# EasyEDA Pro project ProProject_PetCareSTM32_MiniSTM32_2024-08-27_1.epro

# Schematic Schematic1
Create Date: 2024-08-11; Page Name: P1; Project Name: PetCareSTM32_MiniSTM32; Schematic Name: Schematic1; Update Date: 2024-08-25; Company: 嘉立创EDA; Page Size: A4; Version: V1.0
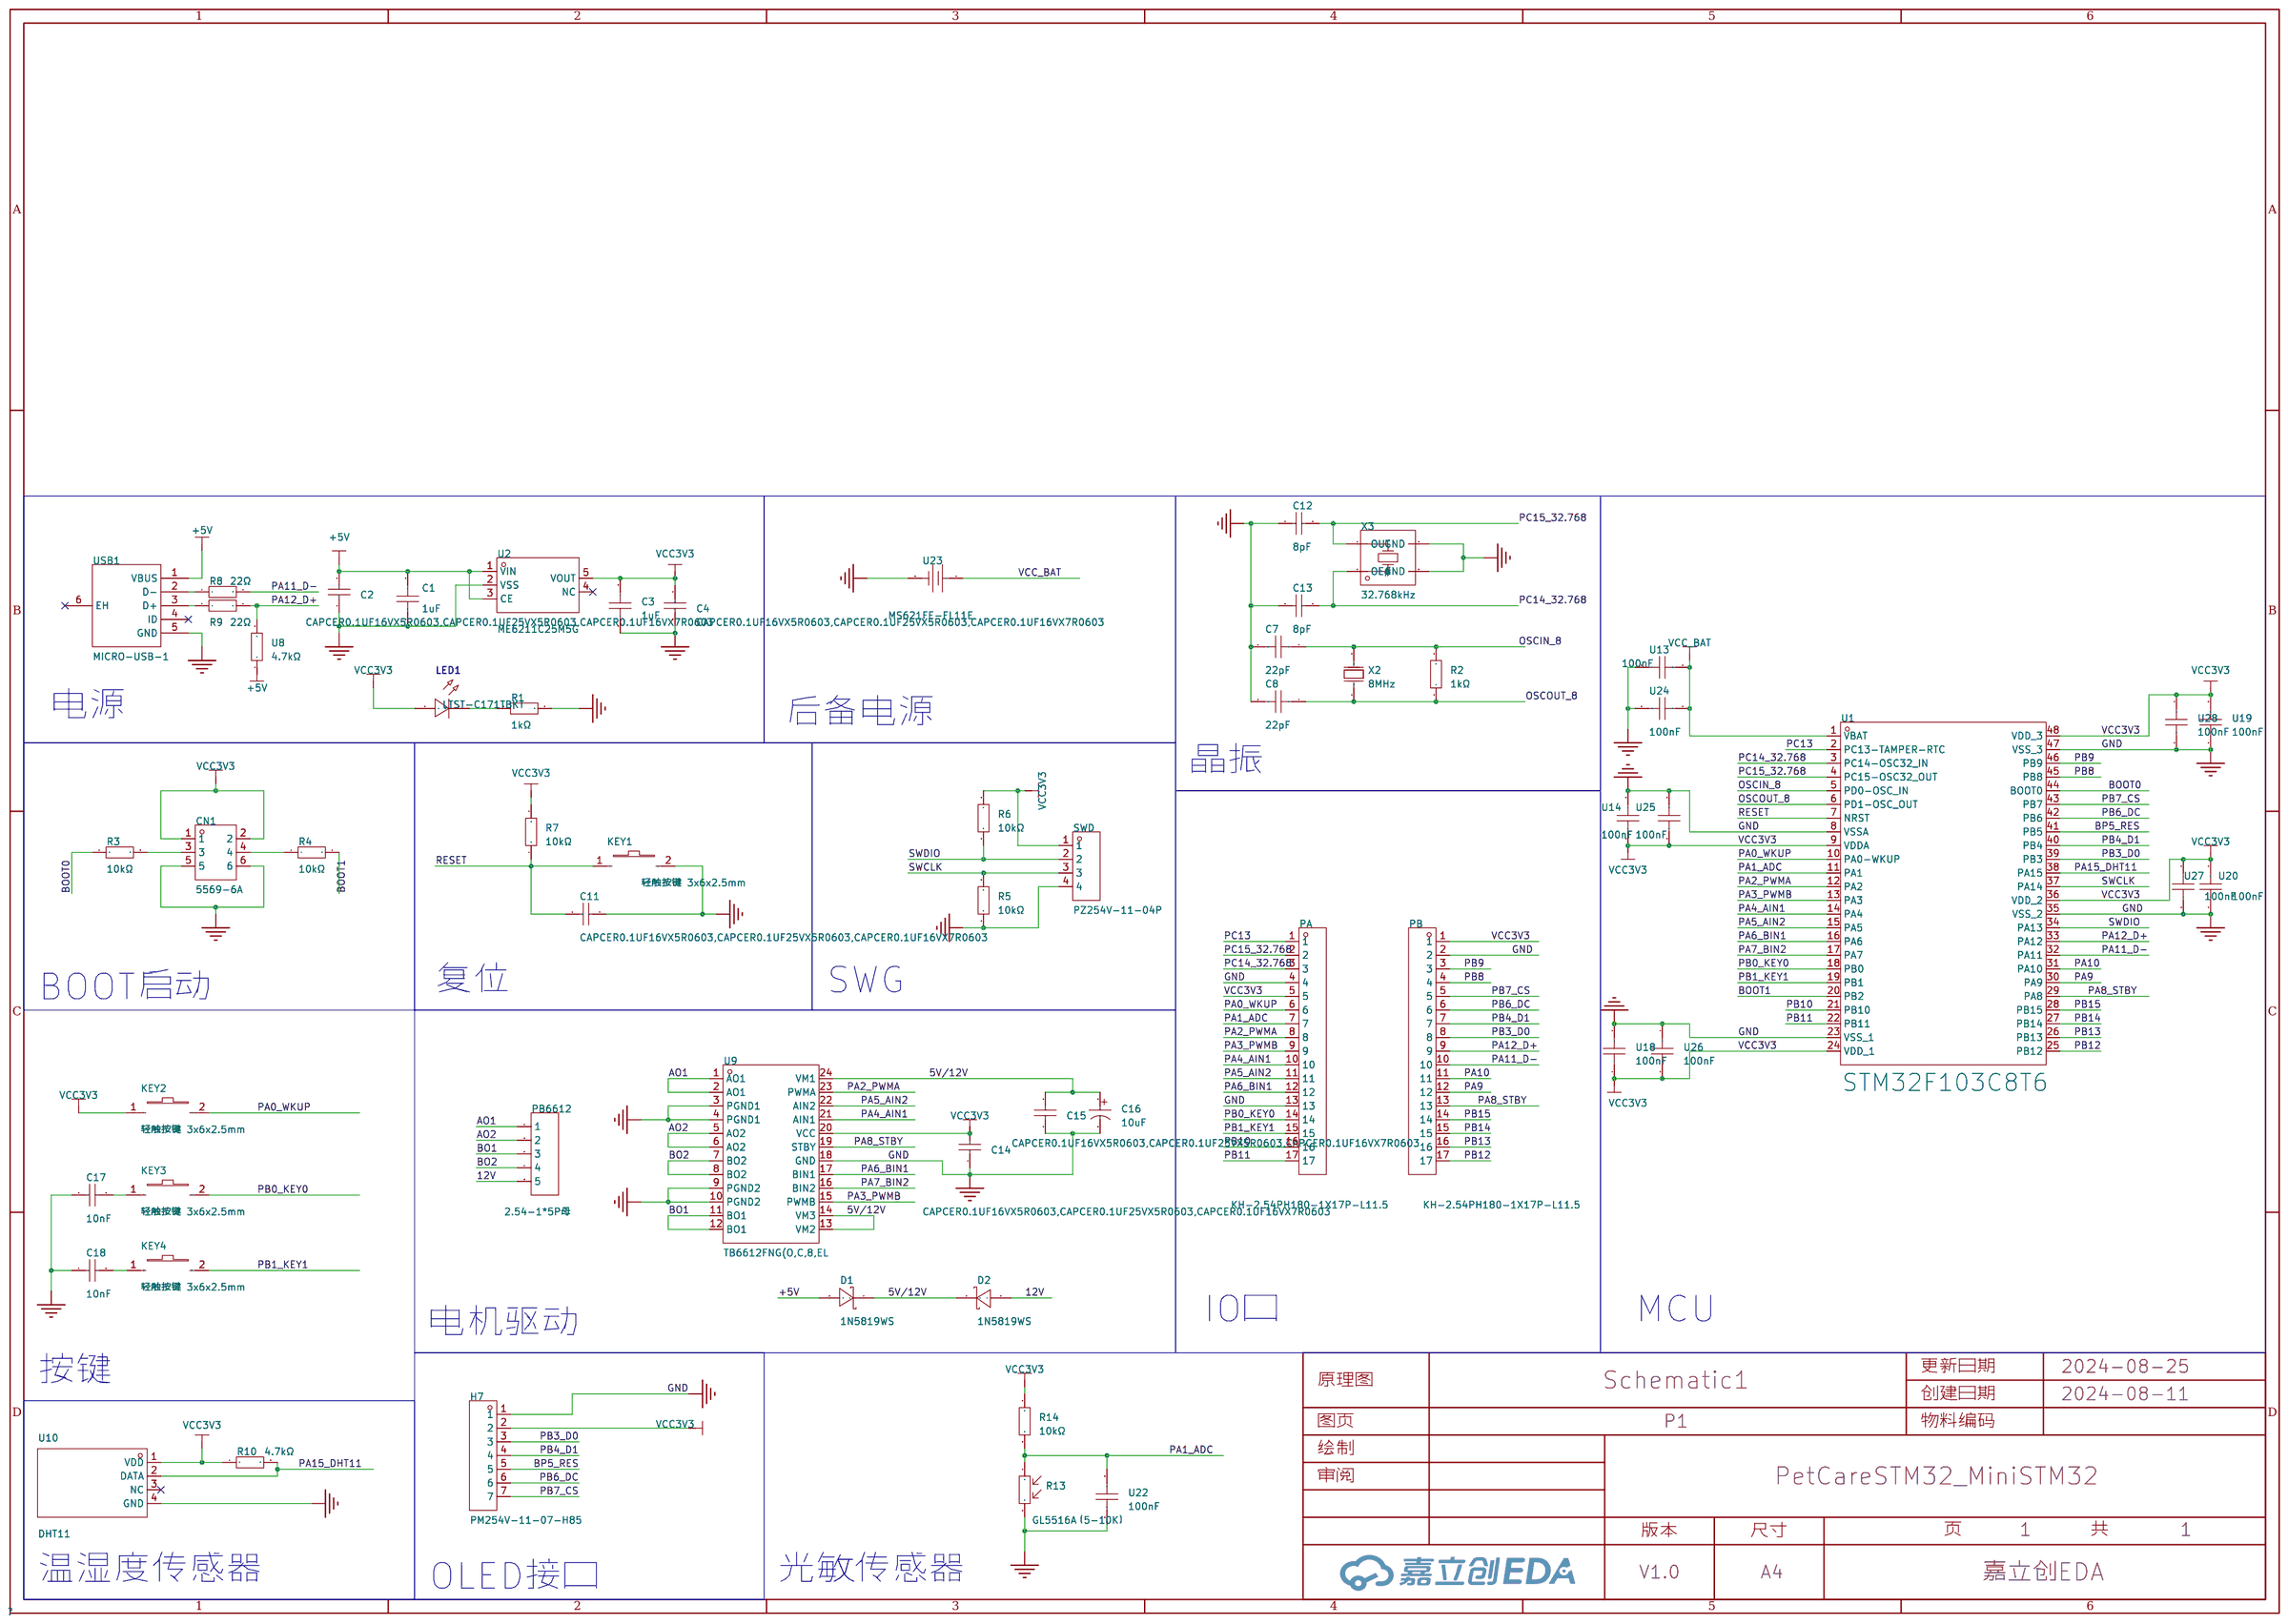
[diagram p0: schematic sheet]

## Parts
C1  1uF  [C0603]
C2  CAPCER0.1UF16VX5R0603,CAPCER0.1UF25VX5R0603,CAPCER0.1UF16VX7R0603  [C0603]
C3  1uF  [C0603]
C4  CAPCER0.1UF16VX5R0603,CAPCER0.1UF25VX5R0603,CAPCER0.1UF16VX7R0603  [C0603]
C7  22pF  [C0603]
C8  22pF  [C0603]
C11  CAPCER0.1UF16VX5R0603,CAPCER0.1UF25VX5R0603,CAPCER0.1UF16VX7R0603  [C0603]
C12  8pF  [C0603]
C13  8pF  [C0603]
C14  CAPCER0.1UF16VX5R0603,CAPCER0.1UF25VX5R0603,CAPCER0.1UF16VX7R0603  [C0603]
C15  CAPCER0.1UF16VX5R0603,CAPCER0.1UF25VX5R0603,CAPCER0.1UF16VX7R0603  [C0603]
C16  10uF  [CAP-TH_BD5.0-P2.00-D0.8-FD]
C17  10nF  [C0603]
C18  10nF  [C0603]
CN1  5569-6A  [CONN-TH_6P-P4.20_5569-6A-1]
D1  1N5819WS  [SOD-323_L1.8-W1.3-LS2.5-RD]
D2  1N5819WS  [SOD-323_L1.8-W1.3-LS2.5-RD]
H7  PM254V-11-07-H85  [HDR-TH_7P-P2.54-V-F]
KEY1  轻触按键 3x6x2.5mm  [SW-SMD_L6.0-W3.6-LS8.0]
KEY2  轻触按键 3x6x2.5mm  [SW-SMD_L6.0-W3.6-LS8.0]
KEY3  轻触按键 3x6x2.5mm  [SW-SMD_L6.0-W3.6-LS8.0]
KEY4  轻触按键 3x6x2.5mm  [SW-SMD_L6.0-W3.6-LS8.0]
LED1  LTST-C171TBKT  [LED0805-RD_BLUE]
PA  KH-2.54PH180-1X17P-L11.5  [HDR-TH_17P-P2.54-V-M]
PB  KH-2.54PH180-1X17P-L11.5  [HDR-TH_17P-P2.54-V-M]
PB6612  2.54-1*5P母  [HDR-TH_5P-P2.54-V-F]
R1  1kΩ  [R0603]
R2  1kΩ  [R0603]
R3  10kΩ  [R0603]
R4  10kΩ  [R0603]
R5  10kΩ  [R0603]
R6  10kΩ  [R0603]
R7  10kΩ  [R0603]
R8  22Ω  [R0805]
R9  22Ω  [R0805]
R10  4.7kΩ  [R1206]
R13  GL5516A（5-10K）  [RES-TH_L5.1-W4.3-P3.40_GL55]
R14  10kΩ  [R0603]
SWD  PZ254V-11-04P  [HDR-TH_4P-P2.54-V-M]
U1  STM32F103C8T6  [LQFP-48_L7.0-W7.0-P0.50-LS9.0-BL]
U2  ME6211C25M5G  [SOT-23-5_L2.9-W1.7-P0.95-LS2.8-BL]
U8  4.7kΩ  [R0603]
U9  TB6612FNG(O,C,8,EL  [SSOP-24_L8.4-W5.8-P0.65-LS7.8-BL]
U10  DHT11  [SENSOR-TH_DHT11]
U13  100nF  [C0603]
U14  100nF  [C0603]
U18  100nF  [C0603]
U19  100nF  [C0603]
U20  100nF  [C0603]
U22  100nF  [C0603]
U23  MS621FE-FL11E  [BAT-SMD_FL11E]
U24  100nF  [C0603]
U25  100nF  [C0603]
U26  100nF  [C0603]
U27  100nF  [C0603]
U28  100nF  [C0603]
USB1  MICRO-USB-1  [MICRO-USB-SMD_C9900008946]
X2  8MHz  [OSC-SMD_L5.0-W3.2]
X3  32.768kHz  [CRYSTAL-SMD_4P-L8.0-W3.8-BL]

## Library data of the parts
C1 C3 = CL10A105KB8NNNC: 容值:1uF;精度:±10%;额定电压:50V;材质(温度系数):X5R;; LCSC Part Name: 1uF ±10% 50V; Supplier Part: C15849; Manufacturer: SAMSUNG(三星); Supplier Footprint: 0603; JLCPCB Part Class: Basic Part; Datasheet: https://atta.szlcsc.com/upload/public/pdf/source/20160218/1457707763339.pdf; Supplier: LCSC; Tolerance: ±10%; Voltage Rated: 50V; Temperature Coefficient: X5R
C2 C4 C11 C14 C15 = CAPCER0.1UF16VX5R0603,CAPCER0.1UF25VX5R0603,CAPCER0.1UF16VX7R0603: Supplier Part: C9900012833; JLCPCB Part Class: Extended Part; Supplier: LCSC
C7 C8 = CL10C220JB81PNC: 容值:22pF;精度:±5%;额定电压:50V;材质(温度系数):C0G;; LCSC Part Name: 22pF ±5% 50V; Supplier Part: C170132; Manufacturer: SAMSUNG(三星); Supplier Footprint: 0603; JLCPCB Part Class: Extended Part; Datasheet: https://atta.szlcsc.com/upload/public/pdf/source/20180126/C170132_15169630833661310807.pdf; Supplier: LCSC; Tolerance: ±5%; Voltage Rated: 50V; Temperature Coefficient: C0G
C12 C13 = 0603CG8R0C500NT: 容值:8pF;额定电压:50V;材质(温度系数):C0G;; LCSC Part Name: 8pF 50V; Supplier Part: C36508; Manufacturer: FH(风华); Supplier Footprint: 0603; JLCPCB Part Class: Extended Part; Datasheet: https://atta.szlcsc.com/upload/public/pdf/source/20200305/C486355_26A10D38EF8C2A5C37091D0039909270.pdf; Supplier: LCSC; Voltage Rated: 50V; Temperature Coefficient: C0G
C16 = KF100M025C110A: 容值:10uF;精度:±20%;额定电压:25V;; LCSC Part Name: 10uF ±20% 25V; Supplier Part: C62930; Manufacturer: CapXon(丰宾); Supplier Footprint: 插件,D5xL11mm; JLCPCB Part Class: Extended Part; Datasheet: https://atta.szlcsc.com/upload/public/pdf/source/20160702/1467448308274.pdf; Supplier: LCSC; Tolerance: ±20%; Rated Voltage: 25V; Lead Spacing: 2mm; φD: 5mm; L: 11mm; Lifetime @ Temp: 2000hrs@105℃
C17 C18 = CC0603KRX7R9BB103: 容值:10nF;精度:±10%;额定电压:50V;材质(温度系数):X7R;; LCSC Part Name: 10nF ±10% 50V; Supplier Part: C100042; Manufacturer: YAGEO(国巨); Supplier Footprint: 0603; JLCPCB Part Class: Extended Part; Datasheet: https://atta.szlcsc.com/upload/public/pdf/source/20181008/C309510_22F155564471FAF6A489F7D68F34234E.pdf; Supplier: LCSC; Tolerance: ±10%; Voltage Rated: 50V; Temperature Coefficient: X7R
CN1 = 5569-6A: Supplier Part: C9900070523; Supplier Footprint: 2*3p; JLCPCB Part Class: Extended Part; Supplier: LCSC
D1 D2 = 1N5819WS_C191023: 正向压降(Vf):600mV@1A;直流反向耐压(Vr):40V;平均整流电流(Io):1A;; LCSC Part Name: 电压:40V 电流:1A; Supplier Part: C191023; Manufacturer: Hottech(合科泰); Supplier Footprint: SOD-323; JLCPCB Part Class: Basic Part; Datasheet: https://atta.szlcsc.com/upload/public/pdf/source/20220428/3CB86FD8D28D653594B4E35F9D5AEFD9.pdf; Supplier: LCSC; Forward Voltage (Vf@If): 600mV@1A; Reverse Voltage (Vr): 40V; Average Rectified Current (Io): 1A
H7 = PM254V-11-07-H85: 插孔结构:1x7P;间距:2.54mm;行距:-;圆孔/方孔:方孔;安装类型:直插;排数:单排;总孔位数:7P;额定电流:3A;额定电压:250V;插孔方向:顶部;塑高:-;工作温度范围:-40℃~+105℃;; LCSC Part Name: 间距:2.54mm 1x7P 直插; Supplier Part: C2832270; Manufacturer: XFCN(兴飞); Supplier Footprint: 插件,P=2.54mm; JLCPCB Part Class: Extended Part; Datasheet: https://atta.szlcsc.com/upload/public/pdf/source/20210514/C2832270_F424CC0071A81298BFB56B53406F9842.pdf; Supplier: LCSC; Holes Structure: 1x7P; Pitch: 2.54mm; Circular Hole / Square Hole: 方孔; Mounting Type: 直插; Number of Rows: 单排; Number of Holes: 7P; Current Rating (Max): 3A; Voltage Rating (Max): 250V; Holes Direction: 顶部; Operating Temperature Range: -40℃~+105℃
KEY1-KEY4 = 轻触按键 3x6x2.5mm: LCSC Part Name: 3x6x2.5 红头 耐高温; Supplier Part: C5382; Supplier Footprint: SMD; JLCPCB Part Class: Extended Part; Supplier: LCSC
LED1 = LTST-C171TBKT: 发光颜色:蓝色;正向电压(VF):3.3V;功率:76mW;正向电流:20mA;主波长:465nm~475nm;二极管配置:-;透镜颜色:无色透明透镜;色温:-;发光强度:104mcd;发光角度:130°;载带方式:-;工作温度:-20℃~+80℃;; LCSC Part Name: 蓝灯; Supplier Part: C98225; Manufacturer: LITEON(光宝); Supplier Footprint: 0805; JLCPCB Part Class: Extended Part; Datasheet: https://atta.szlcsc.com/upload/public/pdf/source/20170818/C98225_1503051350955895434.pdf; Supplier: LCSC; Emitted Color: 蓝色; Forward Voltage (VF): 3.3V; Power Dissipation: 76mW; Forward Current: 20mA; Dominant Wavelength: 465nm~475nm; Peak Wavelength: 468nm; Lens Color: 无色透明透镜; Luminous Intensity: 104mcd; Viewing Angle: 130°; Operating Temperature: -20℃~+80℃
PA PB = KH-2.54PH180-1X17P-L11.5: 插针结构:1x17P;间距:2.54mm;行距:-;圆针/方针:方针;安装类型:直插;排数:单排;总PIN位数:17P;额定电流:3A;额定电压:-;配合针长度:6mm;塑高:2.5mm;端接针长度:3mm;工作温度范围:-40℃~+105℃;颜色:黑色;; LCSC Part Name: 间距:2.54mm 1x17P 直插 方针; Supplier Part: C2932705; Manufacturer: kinghelm(金航标); Supplier Footprint: 插件,P=2.54mm; JLCPCB Part Class: Extended Part; Datasheet: https://atta.szlcsc.com/upload/public/pdf/source/20211220/20932CDD9C2552710798341E35ADE8E4.pdf; Supplier: LCSC; Pin Structure: 1x17P; Pitch: 2.54mm; Circluar Pins/Square Pins: 方针; Mounting Type: 直插; Number of Rows: 单排; Number of Pins: 17P; Current Rating (Max): 3A; Length of Mating Pin: 6mm; Insulation Height: 2.5mm; Length of End Connection Pin: 3mm; Operating Temperature Range: -40℃~+105℃; Color: 黑色
PB6612 = 2.54-1*5P母: 插孔结构:1x5P;间距:2.54mm;行距:-;安装类型:直插;排数:单排;总孔位数:5P;塑高:-;触头材质:-;触头镀层:-;; LCSC Part Name: 间距:2.54mm 1x5P 直插; Supplier Part: C50950; Manufacturer: BOOMELE(博穆精密); Supplier Footprint: 插件,P=2.54mm; JLCPCB Part Class: Extended Part; Datasheet: https://atta.szlcsc.com/upload/public/pdf/source/20210301/C2718488_F4427B881E42CAA8DDB0B1C12B3A522C.pdf; Supplier: LCSC; Holes Structure: 1x5P; Pitch: 2.54mm; Mounting Type: 直插; Number of Rows: 单排; Number of Holes: 5P
R1 = RC0603FR-071KL: 电阻类型:厚膜电阻;阻值:1kΩ;精度:±1%;功率:100mW;最大工作电压:75V;温度系数:±100ppm/℃;; LCSC Part Name: 厚膜电阻 1kΩ ±1% 100mW; Supplier Part: C22548; Manufacturer: YAGEO(国巨); Supplier Footprint: 0603; JLCPCB Part Class: Extended Part; Datasheet: https://atta.szlcsc.com/upload/public/pdf/source/20180316/70C0E2BDAE7FCC62C531A5A58D202EE1.pdf; Supplier: LCSC; Type: 厚膜电阻; Tolerance: ±1%; Power(Watts): 100mW; Overload Voltage (Max): 75V; Temperature Coefficient: ±100ppm/℃; Operating Temperature Range: -55℃~+155℃
R2 = 0603WAD1001T5E: 电阻类型:厚膜电阻;阻值:1kΩ;精度:±0.5%;功率:100mW;最大工作电压:75V;温度系数:±100ppm/℃;; LCSC Part Name: 1kΩ ±0.5% 100mW 厚膜电阻; Supplier Part: C51218; Manufacturer: UNI-ROYAL(厚声); Supplier Footprint: 0603; JLCPCB Part Class: Extended Part; Datasheet: https://atta.szlcsc.com/upload/public/pdf/source/20200306/C422600_1E6D84923E4A46A82E41ADD87F860B5C.pdf; Supplier: LCSC; Type: 厚膜电阻; Tolerance: ±0.5%; Power(Watts): 100mW; Overload Voltage (Max): 75V; Temperature Coefficient: ±100ppm/℃; Operating Temperature Range: -55℃~+155℃
R3-R7 R14 = 0603WAF1002T5E: 电阻类型:厚膜电阻;阻值:10kΩ;精度:±1%;功率:100mW;最大工作电压:75V;温度系数:±100ppm/℃;; LCSC Part Name: 厚膜电阻 10kΩ ±1% 100mW; Supplier Part: C25804; Manufacturer: UNI-ROYAL(厚声); Supplier Footprint: 0603; JLCPCB Part Class: Basic Part; Datasheet: https://atta.szlcsc.com/upload/public/pdf/source/20200306/C422600_1E6D84923E4A46A82E41ADD87F860B5C.pdf; Supplier: LCSC; Type: 厚膜电阻; Tolerance: ±1%; Power(Watts): 100mW; Overload Voltage (Max): 75V; Temperature Coefficient: ±100ppm/℃; Operating Temperature Range: -55℃~+155℃
R8 R9 = TC0525F220JT5E: 电阻类型:薄膜电阻;阻值:22Ω;精度:±1%;功率:250mW;最大工作电压:150V;温度系数:±25ppm/℃;; LCSC Part Name: 22Ω ±1% 250mW 薄膜电阻; Supplier Part: C65068; Manufacturer: UNI-ROYAL(厚声); Supplier Footprint: 0805; JLCPCB Part Class: Extended Part; Datasheet: https://atta.szlcsc.com/upload/public/pdf/source/20190904/C425668_F2F639A313B6F33D501F342892FD5229.pdf; Supplier: LCSC; Type: 薄膜电阻; Tolerance: ±1%; Power(Watts): 250mW; Overload Voltage (Max): 150V; Temperature Coefficient: ±25ppm/℃; Operating Temperature Range: -55℃~+155℃
R10 = 1206W4F4701T5E: 电阻类型:厚膜电阻;阻值:4.7kΩ;精度:±1%;功率:250mW;最大工作电压:200V;温度系数:±100ppm/℃;; LCSC Part Name: 4.7kΩ ±1% 250mW 厚膜电阻; Supplier Part: C17936; Manufacturer: UNI-ROYAL(厚声); Supplier Footprint: 1206; JLCPCB Part Class: Basic Part; Datasheet: https://atta.szlcsc.com/upload/public/pdf/source/20200306/C422600_1E6D84923E4A46A82E41ADD87F860B5C.pdf; Supplier: LCSC; Type: 厚膜电阻; Tolerance: ±1%; Power(Watts): 250mW; Overload Voltage (Max): 200V; Temperature Coefficient: ±100ppm/℃; Operating Temperature Range: -55℃~+155℃
R13 = GL5516A（5-10K）: 暗电阻:200kΩ;亮电阻 @ 10Lux:5kΩ~10kΩ;光谱峰值(波长):540nm;; LCSC Part Name: 亮电阻:5kΩ~10kΩ 暗电阻:200kΩ; Supplier Part: C11307; Manufacturer: JCHL(晶创和立); Supplier Footprint: 插件,P=3.4mm; JLCPCB Part Class: Extended Part; Datasheet: https://atta.szlcsc.com/upload/public/pdf/source/20200417/C515010_C10502EF7F431E893A7F20DB83F527F0.pdf; Supplier: LCSC; Dark Resistance: 200kΩ; Illuminated Resistance @ 10Lux: 5kΩ~10kΩ; Applied Voltage: 150V; Spectral Peak: 540nm
SWD = PZ254V-11-04P: 插针结构:1x4P;间距:2.54mm;行距:-;圆针/方针:方针;安装类型:直插;排数:单排;总PIN位数:4P;额定电流:3A;额定电压:250V;配合针长度:6mm;塑高:2.5mm;端接针长度:3mm;触头材质:-;工作温度范围:-40℃~+105℃;颜色:黑色;; LCSC Part Name: 间距:2.54mm 1x4P 直插 方针; Supplier Part: C2691448; Manufacturer: XFCN(兴飞); Supplier Footprint: 插件,P=2.54mm; JLCPCB Part Class: Extended Part; Datasheet: https://atta.szlcsc.com/upload/public/pdf/source/20200309/C492403_F9F19131791D08044AD4F84F8E751A34.pdf; Supplier: LCSC; Pin Structure: 1x4P; Pitch: 2.54mm; Circluar Pins/Square Pins: 方针; Mounting Type: 直插; Number of Rows: 单排; Number of Pins: 4P; Current Rating (Max): 3A; Voltage Rating (Max): 250V; Length of Mating Pin: 6mm; Insulation Height: 2.5mm; Length of End Connection Pin: 3mm; Operating Temperature Range: -40℃~+105℃; Color: 黑色
U1 = STM32F103C8T6: CPU内核:ARM-M3;程序存储容量:64KB;RAM总容量:20KB;GPIO端口数量:37;工作电压范围:2V~3.6V;CPU最大主频:72MHz;程序存储器类型:FLASH;; LCSC Part Name: 主流增强型ARM Cortex-M3 MCU，具有64 KB Flash、72 MHz CPU、电机控制、USB和CAN; Supplier Part: C8734; Manufacturer: ST(意法半导体); Supplier Footprint: LQFP-48(7x7); JLCPCB Part Class: 扩展库; Datasheet: https://atta.szlcsc.com/upload/public/pdf/source/20220812/8363ACEC51AD55ECEB84799464F7CB85.pdf; Supplier: LCSC; CPU Core: ARM-M3; Program Storage Size: 64KB; RAM Size: 20KB; GPIO Ports Number: 37; Operating Voltage Range: 2V~3.6V; CPU Maximum Speed: 72MHz; Program Memory Type: FLASH; Operating Temperature Range: -40℃~+85℃; ADC (Bit): 12bit; Universal Serial Bus: 有; Peripheral/Function: 看门狗；DMA；看门狗；温度传感器; Watchdog: 有; Infrared Data Association: 有; Low-Voltage Detect: 有; Direct Memory Access: 有; Internal Oscillator: 有
U2 = ME6211C25M5G: LCSC Part Name: ME6211C25M5G 停产; Supplier Part: C2835813; Manufacturer: MICRONE(南京微盟); Supplier Footprint: SOT-23-5; JLCPCB Part Class: Extended Part; Datasheet: https://atta.szlcsc.com/upload/public/pdf/source/20211210/ACC7C3E9BA56F250BF966425916E32B9.pdf; Supplier: LCSC
U8 = AR03FTDX4701A: 电阻类型:薄膜电阻;阻值:4.7kΩ;精度:±1%;功率:100mW;最大工作电压:75V;温度系数:±50ppm/℃;; LCSC Part Name: 薄膜电阻 4.7kΩ ±1% 100mW; Supplier Part: C2924150; Manufacturer: Viking(光颉); Supplier Footprint: 0603; JLCPCB Part Class: Extended Part; Datasheet: https://atta.szlcsc.com/upload/public/pdf/source/20211123/7AFDB03DAF68AA91648A852AAE26A3AB.pdf; Supplier: LCSC; Type: 薄膜电阻; Tolerance: ±1%; Power(Watts): 100mW; Overload Voltage (Max): 75V; Temperature Coefficient: ±50ppm/℃; Operating Temperature Range: -55℃~+155℃
U9 = TB6612FNG(O,C,8,EL: 双直流电机驱动器集成电路; Supplier Part: C88224; Manufacturer: TOSHIBA(东芝); Supplier Footprint: SSOP-24-208mil; JLCPCB Part Class: Extended Part; Datasheet: https://atta.szlcsc.com/upload/public/pdf/source/20171128/C141517_15118625624231147036.pdf; Supplier: LCSC
U10 = DHT11: 新款电容式数字温湿度传感器,老款已停产16.1x12.6x5.8mm; LCSC Part Name: DHT11  电容式传感器; Supplier Part: C117051; Manufacturer: 广州奥松; Supplier Footprint: SIP-4; JLCPCB Part Class: Extended Part; Datasheet: https://atta.szlcsc.com/upload/public/pdf/source/20170703/1499081238365.pdf; Supplier: LCSC
U13 U14 U18-U20 U22 U24-U28 = CGA0603X7R104K500JT: 容值:100nF;精度:±10%;额定电压:50V;材质(温度系数):X7R;; LCSC Part Name: 100nF ±10% 50V; Supplier Part: C6119867; Manufacturer: HRE(芯声); Supplier Footprint: 0603; JLCPCB Part Class: Extended Part; Supplier: LCSC; Tolerance: ±10%; Voltage Rated: 50V; Temperature Coefficient: X7R
U23 = MS621FE-FL11E: FL11E 3.3V可充电纽扣电池 5.5mAH; LCSC Part Name: Seiko/精工，可充电纽扣电池，3V，MS621FE-FL11E，1个; Supplier Part: C80909; Manufacturer: Seiko(精工); JLCPCB Part Class: Extended Part; Datasheet: https://atta.szlcsc.com/upload/public/pdf/source/20230719/88F2811CC6B30DD05F1C5A5953BF9E77.pdf; Supplier: LCSC; voltage: 3 V; capacity: 5.5mAh; chemical composition: 锂离子; temperature range: -20-60°C; type: 纽扣; characteristic: 可充电; Packaging quantity: 1; Battery capacity: -；-；-
USB1 = MICRO-USB-1: Supplier Part: C9900008946; Supplier Footprint: USB-micro; JLCPCB Part Class: Extended Part; Supplier: LCSC
X2 = ABM3-8.000MHZ-D2Y-T: 晶振类型:贴片晶振;频率:8MHz;常温频差:±20ppm;外接负载电容:18pF;频率稳定度(全温):±30ppm;; LCSC Part Name: 8MHz ±20ppm 18pF; Supplier Part: C144380; Manufacturer: ABRACON; Supplier Footprint: SMD5032; JLCPCB Part Class: Extended Part; Datasheet: https://atta.szlcsc.com/upload/public/pdf/source/20180613/C148313_0A3B1F233FF88ED3B220BE4C181ABF14.pdf; Supplier: LCSC; Crystal Type: 贴片晶振; Normal temperature Frequency Tolerance: ±20ppm; External load capacitor: 18pF; Frequency Stability(Full temperature range): ±30ppm; Equivalent Series Resistance (ESR): 140Ω; Operating Temperature: -40℃~+85℃
X3 = ABS25-32.768KHZ-T: 晶振类型:-;频率:32.768kHz;常温频差:±20ppm;外接负载电容:12.5pF;频率稳定度(全温):-;; LCSC Part Name: 32.768kHz ±20ppm 12.5pF; Supplier Part: C179637; Manufacturer: ABRACON; Supplier Footprint: MC-306; JLCPCB Part Class: 扩展库; Datasheet: https://atta.szlcsc.com/upload/public/pdf/source/20180207/C179637_15179896523281356363.pdf; Supplier: LCSC; Normal temperature Frequency Tolerance: ±20ppm; External load capacitor: 12.5pF; Equivalent Series Resistance (ESR): 50kΩ; Operating Temperature: -40℃~+85℃

## Nets
5V/12V: C15.2 C16.1 D1.1(K) D2.1(K) U9.13(VM2) U9.14(VM3) U9.24(VM1)
12V: D2.2(A) PB6612.5
+5V: C1.2 C2.2 D1.2(A) U2.1(VIN) U2.3(CE) U8.1 USB1.1(VBUS)
GND: C1.1 C2.1 C3.1 C4.1 C7.2 C8.2 C11.2 C12.1 C13.1 C14.1 C15.1 C16.2 C17.2 C18.1 CN1.5 CN1.6 H7.1 KEY1.2 PA.4 PA.13 PB.2 R1.2 R5.1 R13.2 SWD.4 U1.8(VSSA) U1.23(VSS_1) U1.35(VSS_2) U1.47(VSS_3) U2.2(VSS) U9.3(PGND1) U9.4(PGND1) U9.9(PGND2) U9.10(PGND2) U9.18(GND) U10.4(GND) U13.2 U14.2 U18.2 U19.1 U20.1 U22.1 U23.2(-) U24.2 U25.1 U26.1 U27.2 U28.2 USB1.5(GND) X3.2(GND) X3.3(GND)
VCC3V3: C3.2 C4.2 C14.2 CN1.1 CN1.2 H7.2 KEY2.1 LED1.2(A) PA.5 PB.1 R6.2 R7.2 R10.1 R14.2 SWD.1 U1.9(VDDA) U1.24(VDD_1) U1.36(VDD_2) U1.48(VDD_3) U2.5(VOUT) U9.20(VCC) U10.1(VDD) U14.1 U18.1 U19.2 U20.2 U25.2 U26.2 U27.1 U28.1
VCC_BAT: U1.1(VBAT) U13.1 U23.1(+) U24.1
AO1: PB6612.1 U9.1(AO1) U9.2(AO1)
AO2: PB6612.2 U9.5(AO2) U9.6(AO2)
BO1: PB6612.3 U9.11(BO1) U9.12(BO1)
BO2: PB6612.4 U9.7(BO2) U9.8(BO2)
BOOT0: R3.1 U1.44(BOOT0)
BOOT1: R4.2 U1.20(PB2)
BP5_RES: H7.5 U1.41(PB5)
OSCIN_8: C7.1 R2.2 U1.5(PD0-OSC_IN) X2.2(OSC2)
OSCOUT_8: C8.1 R2.1 U1.6(PD1-OSC_OUT) X2.1(OSC1)
PA0_WKUP: KEY2.2 PA.6 U1.10(PA0-WKUP)
PA1_ADC: PA.7 R13.1 R14.1 U1.11(PA1) U22.2
PA2_PWMA: PA.8 U1.12(PA2) U9.23(PWMA)
PA3_PWMB: PA.9 U1.13(PA3) U9.15(PWMB)
PA4_AIN1: PA.10 U1.14(PA4) U9.21(AIN1)
PA5_AIN2: PA.11 U1.15(PA5) U9.22(AIN2)
PA6_BIN1: PA.12 U1.16(PA6) U9.17(BIN1)
PA7_BIN2: U1.17(PA7) U9.16(BIN2)
PA8_STBY: PB.13 U1.29(PA8) U9.19(STBY)
PA9: PB.12 U1.30(PA9)
PA10: PB.11 U1.31(PA10)
PA11_D-: PB.10 R8.2 U1.32(PA11)
PA12_D+: PB.9 R9.2 U1.33(PA12) U8.2
PA15_DHT11: R10.2 U1.38(PA15) U10.2(DATA)
PB0_KEY0: KEY3.2 PA.14 U1.18(PB0)
PB1_KEY1: KEY4.2 PA.15 U1.19(PB1)
PB3_D0: H7.3 PB.8 U1.39(PB3)
PB4_D1: H7.4 PB.7 U1.40(PB4)
PB6_DC: H7.6 PB.6 U1.42(PB6)
PB7_CS: H7.7 PB.5 U1.43(PB7)
PB8: PB.4 U1.45(PB8)
PB9: PB.3 U1.46(PB9)
PB10: PA.16 U1.21(PB10)
PB11: PA.17 U1.22(PB11)
PB12: PB.17 U1.25(PB12)
PB13: PB.16 U1.26(PB13)
PB14: PB.15 U1.27(PB14)
PB15: PB.14 U1.28(PB15)
PC13: PA.1 U1.2(PC13-TAMPER-RTC)
PC14_32.768: C13.2 PA.3 U1.3(PC14-OSC32_IN) X3.1(OE#)
PC15_32.768: C12.2 PA.2 U1.4(PC15-OSC32_OUT) X3.4(OUT)
RESET: C11.1 KEY1.1 R7.1 U1.7(NRST)
SWCLK: R5.2 SWD.3 U1.37(PA14)
SWDIO: R6.1 SWD.2 U1.34(PA13)
$1N4524: LED1.1(C) R1.1
$1N6705: CN1.3 R3.2
$1N6712: CN1.4 R4.1
$1N8192: R8.1 USB1.2(D-)
$1N8237: R9.1 USB1.3(D+)
$1N32184: C17.1 KEY3.1
$1N32195: C18.2 KEY4.1

Not connected (* = marked no-connect by the designer): U2 4(NC)*; U10 3(NC)*; USB1 4(ID)* 6(EH)*

## Notes on the sheet
- 电源
- 后备电源
- 晶振
- BOOT启动
- 复位
- SWG
- IO口
- MCU
- 电机驱动
- 按键
- 温湿度传感器
- 光敏传感器
- OLED接口

# Board PCB1
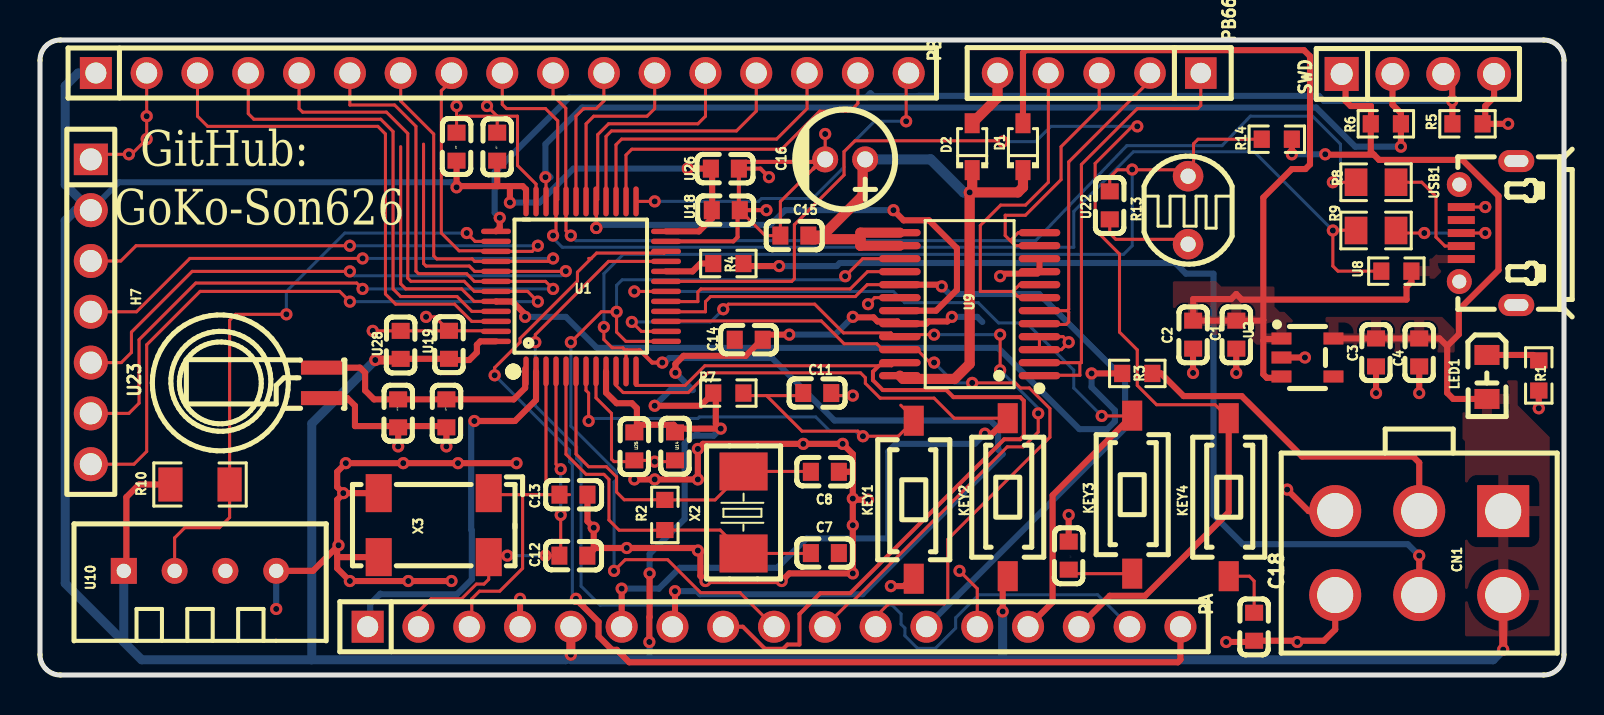
[diagram p1: board, top side]
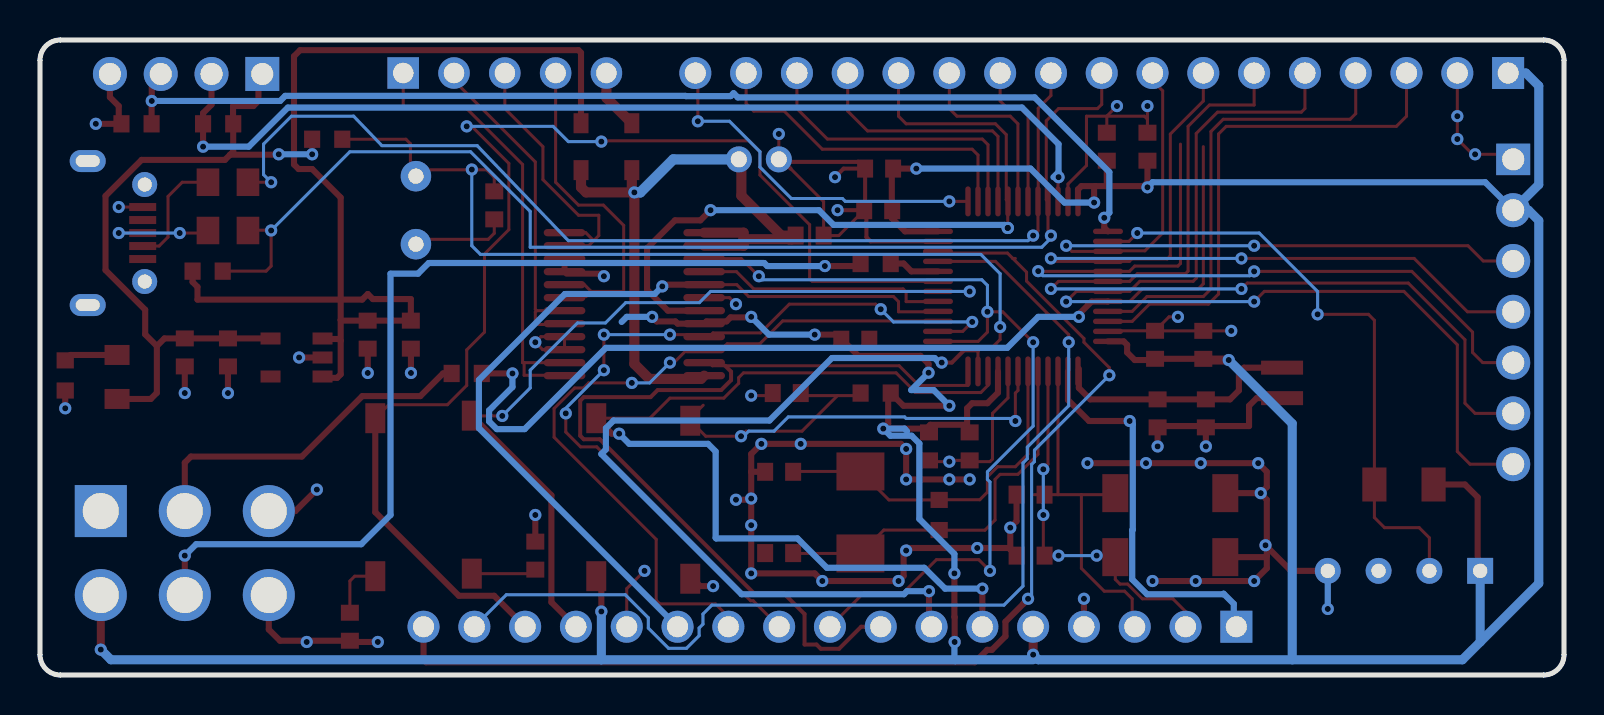
[diagram p2: board, bottom side, seen from below]

Outline 76.2 x 31.75 mm; copper layers: Top Layer, Bottom Layer. Coordinates in mm from the lower left corner of the outline.
Outline path: 0,30.73 0,1.02 arc(0.3,0.3) 1.02,0 75.18,0 arc(75.9,0.3) 76.2,1.02 76.2,30.73 arc(75.9,31.45) 75.18,31.75 1.02,31.75 arc(0.3,31.45) 0,30.73
Stack: Top Layer 0.035mm / Dielectric1 1.51mm FR4 er 4.5 / Bottom Layer 0.035mm

## Design rules (mm)
net PA11_D-: DP2
net PA12_D+: DP2
net $1N8192: DP1
net $1N8237: DP1
template: 自定义配置
spacing copperThickness1oz (default): track to track 0.203, other pairs 0.203 to 0.203
spacing copperThickness2oz: track to track 0.203, other pairs 0.152 to 0.3
track width copperThickness1oz (default): min 0.152, default 0.152, max 0.305
track width copperThickness2oz: min 0.203, default 0.254, max 2.54
track width 5V: min 0.305, default 0.305, max 0.762
track width 12V: min 0.508, default 0.508, max 0.762
differential pair differentialPair (default): width min 0.152, default 0.152, max 0.152; gap min 0.152, default 0.152
via viaSize (default): diameter min 0.61, default 0.61, max 0.61; hole min 0.305, default 0.305, max 0.305
net VCC_BAT uses 5V
net VCC3V3 uses 5V
net +5V uses 5V
net 5V/12V uses 12V
net 12V uses 12V

## Placement (name value [footprint] x y rotation side)
C1  1uF  [C0603]  59.82 17.02 90 top
C2  CAPCER0.1UF16VX5R0603,CAPCER0.1UF25VX5R0603,CAPCER0.1UF16VX7R0603  [C0603]  57.66 17.02 90 top
C3  1uF  [C0603]  66.8 16.13 90 top
C4  CAPCER0.1UF16VX5R0603,CAPCER0.1UF25VX5R0603,CAPCER0.1UF16VX7R0603  [C0603]  68.96 16.13 90 top
C7  22pF  [C0603]  39.24 6.1 0 top
C8  22pF  [C0603]  39.24 10.16 0 top
C11  CAPCER0.1UF16VX5R0603,CAPCER0.1UF25VX5R0603,CAPCER0.1UF16VX7R0603  [C0603]  38.86 14.1 0 top
C12  8pF  [C0603]  26.67 5.97 180 top
C13  8pF  [C0603]  26.67 9.02 180 top
C14  CAPCER0.1UF16VX5R0603,CAPCER0.1UF25VX5R0603,CAPCER0.1UF16VX7R0603  [C0603]  35.44 16.76 0 top
C15  CAPCER0.1UF16VX5R0603,CAPCER0.1UF25VX5R0603,CAPCER0.1UF16VX7R0603  [C0603]  37.72 21.97 0 top
C16  10uF  [CAP-TH_BD5.0-P2.00-D0.8-FD]  40.26 25.78 180 top
C17  10nF  [C0603]  51.43 5.97 90 top
C18  10nF  [C0603]  60.71 2.41 90 top
CN1  5569-6A  [CONN-TH_6P-P4.20_5569-6A-1]  68.96 6.1 180 top
D1  1N5819WS  [SOD-323_L1.8-W1.3-LS2.5-RD]  49.15 26.42 90 top
D2  1N5819WS  [SOD-323_L1.8-W1.3-LS2.5-RD]  46.61 26.42 90 top
H7  PM254V-11-07-H85  [HDR-TH_7P-P2.54-V-F]  2.54 18.16 270 top
KEY1  轻触按键 3x6x2.5mm  [SW-SMD_L6.0-W3.6-LS8.0]  43.69 8.76 270 top
KEY2  轻触按键 3x6x2.5mm  [SW-SMD_L6.0-W3.6-LS8.0]  48.39 8.89 90 top
KEY3  轻触按键 3x6x2.5mm  [SW-SMD_L6.0-W3.6-LS8.0]  54.61 9.02 90 top
KEY4  轻触按键 3x6x2.5mm  [SW-SMD_L6.0-W3.6-LS8.0]  59.44 8.89 90 top
LED1  LTST-C171TBKT  [LED0805-RD_BLUE]  72.35 14.9 270 top
PA  KH-2.54PH180-1X17P-L11.5  [HDR-TH_17P-P2.54-V-M]  36.7 2.41 0 top
PB  KH-2.54PH180-1X17P-L11.5  [HDR-TH_17P-P2.54-V-M]  23.11 30.1 0 top
PB6612  2.54-1*5P母  [HDR-TH_5P-P2.54-V-F]  52.96 30.1 180 top
R1  1kΩ  [R0603]  74.94 14.98 270 top
R2  1kΩ  [R0603]  31.24 8 270 top
R3  10kΩ  [R0603]  54.86 15.08 0 top
R4  10kΩ  [R0603]  34.42 20.57 180 top
R5  10kΩ  [R0603]  71.37 27.56 180 top
R6  10kΩ  [R0603]  67.29 27.56 180 top
R7  10kΩ  [R0603]  34.42 14.1 180 top
R8  22Ω  [R0805]  66.8 24.64 180 top
R9  22Ω  [R0805]  66.8 22.22 180 top
R10  4.7kΩ  [R1206]  8 9.53 0 top
R13  GL5516A（5-10K）  [RES-TH_L5.1-W4.3-P3.40_GL55]  57.4 23.24 0 top
R14  10kΩ  [R0603]  61.84 26.79 0 top
SWD  PZ254V-11-04P  [HDR-TH_4P-P2.54-V-M]  68.89 30.05 0 top
U1  STM32F103C8T6  [LQFP-48_L7.0-W7.0-P0.50-LS9.0-BL]  27.05 19.43 0 top
U2  ME6211C25M5G  [SOT-23-5_L2.9-W1.7-P0.95-LS2.8-BL]  63.37 15.88 270 top
U8  4.7kΩ  [R0603]  67.82 20.19 180 top
U9  TB6612FNG(O,C,8,EL  [SSOP-24_L8.4-W5.8-P0.65-LS7.8-BL]  46.48 18.54 90 top
U10  DHT11  [SENSOR-TH_DHT11]  8 5.21 0 top
U13  100nF  [C0603]  17.91 13.08 270 top
U14  100nF  [C0603]  31.75 11.43 270 top
U18  100nF  [C0603]  34.29 23.24 0 top
U19  100nF  [C0603]  20.45 16.51 270 top
U20  100nF  [C0603]  20.83 26.42 270 top
U22  100nF  [C0603]  53.49 23.48 90 top
U23  MS621FE-FL11E  [BAT-SMD_FL11E]  14.1 14.61 0 top
U24  100nF  [C0603]  20.32 13.08 270 top
U25  100nF  [C0603]  29.72 11.43 90 top
U26  100nF  [C0603]  34.24 25.32 180 top
U27  100nF  [C0603]  22.86 26.42 90 top
U28  100nF  [C0603]  18.03 16.51 90 top
USB1  MICRO-USB-1  [MICRO-USB-SMD_C9900008946]  72.39 22.1 90 top
X2  8MHz  [OSC-SMD_L5.0-W3.2]  35.18 8.13 270 top
X3  32.768kHz  [CRYSTAL-SMD_4P-L8.0-W3.8-BL]  19.68 7.49 180 top

## Footprints (pads in the part's own frame, mm; a bottom-side part is the same pattern mirrored in y, then rotated)
BAT-SMD_FL11E
  rect 2.1x0.7 smd: 1(0,0.762) 2(0,-0.762)
C0603
  rect 0.8x0.9 smd: 1(-0.7,0) 2(0.7,0)
CAP-TH_BD5.0-P2.00-D0.8-FD
  round 1.3 hole 0.8: 1(-1,0) 2(1,0)
CONN-TH_6P-P4.20_5569-6A-1
  rect 2.6x2.6 hole 1.8: 1(-4.2,-2.1)
  round 2.6 hole 1.8: 2(-4.2,2.1) 3(0,-2.1) 4(0,2.1) 5(4.2,-2.1) 6(4.2,2.1)
CRYSTAL-SMD_4P-L8.0-W3.8-BL
  rect 1.3x1.9 smd: 1(-2.75,-1.6) 2(2.75,-1.6) 3(2.75,1.6) 4(-2.75,1.6)
HDR-TH_4P-P2.54-V-M
  rect 1.7x1.7 hole 1.1: 1(-3.81,0)
  round 1.7 hole 1.1: 2(-1.27,0) 3(1.27,0) 4(3.81,0)
HDR-TH_5P-P2.54-V-F
  rect 1.575x1.575 hole 1.02: 1(-5.08,0)
  round 1.575 hole 1.02: 2(-2.54,0) 3(0,0) 4(2.54,0) 5(5.08,0)
HDR-TH_7P-P2.54-V-F
  rect 1.575x1.7 hole 1.1: 1(-7.62,0)
  round 1.7 hole 1.1: 2(-5.08,0) 3(-2.54,0) 4(0,0) 5(2.54,0) 6(5.08,0) 7(7.62,0)
HDR-TH_17P-P2.54-V-M
  rect 1.6x1.6 hole 1.05: 1(-20.32,0)
  round 1.6 hole 1.05: 2(-17.78,0) 3(-15.24,0) 4(-12.7,0) 5(-10.16,0) 6(-7.62,0) 7(-5.08,0) 8(-2.54,0) 9(0,0) 10(2.54,0) 11(5.08,0) 12(7.62,0) 13(10.16,0) 14(12.7,0) 15(15.24,0) 16(17.78,0) 17(20.32,0)
LED0805-RD_BLUE
  rect 1x1.25 smd: 1(-1.1,0) 2(1.1,0)
LQFP-48_L7.0-W7.0-P0.50-LS9.0-BL
  oval 0.27x1.5 smd: 1(-2.75,-4.25) 2(-2.25,-4.25) 3(-1.75,-4.25) 4(-1.25,-4.25) 5(-0.75,-4.25) 6(-0.25,-4.25) 7(0.25,-4.25) 8(0.75,-4.25) 9(1.25,-4.25) 10(1.75,-4.25) 11(2.25,-4.25) 12(2.75,-4.25) 25(2.75,4.25) 26(2.25,4.25) 27(1.75,4.25) 28(1.25,4.25) 29(0.75,4.25) 30(0.25,4.25) 31(-0.25,4.25) 32(-0.75,4.25) 33(-1.25,4.25) 34(-1.75,4.25) 35(-2.25,4.25) 36(-2.75,4.25)
  oval 1.5x0.27 smd: 13(4.25,-2.75) 14(4.25,-2.25) 15(4.25,-1.75) 16(4.25,-1.25) 17(4.25,-0.75) 18(4.25,-0.25) 19(4.25,0.25) 20(4.25,0.75) 21(4.25,1.25) 22(4.25,1.75) 23(4.25,2.25) 24(4.25,2.75) 37(-4.25,2.75) 38(-4.25,2.25) 39(-4.25,1.75) 40(-4.25,1.25) 41(-4.25,0.75) 42(-4.25,0.25) 43(-4.25,-0.25) 44(-4.25,-0.75) 45(-4.25,-1.25) 46(-4.25,-1.75) 47(-4.25,-2.25) 48(-4.25,-2.75)
MICRO-USB-SMD_C9900008946
  rect 0.4x1.35 smd: 1(-1.3,1.325) 2(-0.65,1.325) 3(0,1.325) 4(0.65,1.325) 5(1.3,1.325)
  oval 1.1x1.8 hole 0.6x1.2: 6(-3.6,-1.425) 6(3.6,-1.425)
  round 1.25 hole 0.7: 6(-2.425,1.425) 6(2.425,1.425)
OSC-SMD_L5.0-W3.2
  rect 1.9x2.4 smd: 1(-2.05,0) 2(2.05,0)
R0603
  rect 0.806x0.864 smd: 1(-0.753,0) 2(0.753,0)
R0805
  rect 1.133x1.377 smd: 1(-1,0) 2(1,0)
R1206
  rect 1.208x1.701 smd: 1(-1.479,0) 2(1.479,0)
RES-TH_L5.1-W4.3-P3.40_GL55
  round 1.524 hole 0.762: 1(0,1.7) 2(0,-1.7)
SENSOR-TH_DHT11
  rect 1.296x1.296 hole 0.711: 1(-3.81,0)
  round 1.296 hole 0.711: 2(-1.27,0) 3(1.27,0) 4(3.81,0)
SOD-323_L1.8-W1.3-LS2.5-RD
  rect 1x0.75 smd: 1(-1.173,0) 2(1.173,0)
SOT-23-5_L2.9-W1.7-P0.95-LS2.8-BL
  rect 0.6x1 smd: 1(-0.95,-1.3) 2(0,-1.3) 3(0.95,-1.3) 4(0.95,1.3) 5(-0.95,1.3)
SSOP-24_L8.4-W5.8-P0.65-LS7.8-BL
  oval 0.364x2.082 smd: 1(-3.575,-3.491) 2(-2.925,-3.491) 3(-2.275,-3.491) 4(-1.625,-3.491) 5(-0.975,-3.491) 6(-0.325,-3.491) 7(0.325,-3.491) 8(0.975,-3.491) 9(1.625,-3.491) 10(2.275,-3.491) 11(2.925,-3.491) 12(3.575,-3.491) 13(3.575,3.491) 14(2.925,3.491) 15(2.275,3.491) 16(1.625,3.491) 17(0.975,3.491) 18(0.325,3.491) 19(-0.325,3.491) 20(-0.975,3.491) 21(-1.625,3.491) 22(-2.275,3.491) 23(-2.925,3.491) 24(-3.575,3.491)
SW-SMD_L6.0-W3.6-LS8.0
  rect 1.5x1 smd: 1(-3.95,0) 2(3.95,0)

## Nets
As in the schematic.

Pads without a net: U2 4; U10 3; USB1 4 6

## Via types
v1: diameter 0.61, hole 0.305, Top Layer to Bottom Layer, 139 vias

## Routing (per net, layer and track width the routed paths; a pad name or vN(x,y) marks a point on that pad's centre or on a via; arc(x,y) is an arc through that point)
5V/12V: length 35.9
  Top Layer w0.508: 46.61,24.13 v1(46.48,24.13) 46.48,15.56 45.73,14.8 43.15,14.8 U9.24 ; 46.61,24.13 D2.1 ; 46.61,24.13 48.89,24.13 49.15,24.38 D1.1 ; U9.13 41.02,22.12 41.02,21.79 ; 41.02,21.79 38.6,21.79 C15.2 39.14,21.97 41.13,23.97 41.13,25.78 ; 41.02,21.79 41.02,21.46 41.02,21.47 U9.14
  Bottom Layer w0.508: 41.13,25.78 44.53,25.78 46.18,24.13 v1(46.48,24.13)
12V: length 2.7
  Top Layer w0.508: D2.2 47.88,28.86 47.88,29.72
+5V: length 54.1
  Top Layer w0.305: 61.17,16.72 61.17,15.03 61.34,14.86 61.9,14.86 ; 61.17,16.72 61.25,16.8 62.05,16.8 U2.1 ; 61.17,16.72 61.17,17.75 ; 61.17,18.77 61.17,23.87 62.59,25.3 63.27,25.3 63.5,25.53 63.5,30.94 63.2,31.24 49.28,31.24 49.15,31.11 D1.2 ; 61.17,18.77 68.33,18.77 68.33,19.41 68.57,19.65 U8.1 ; 61.17,18.77 60.09,18.77 59.81,19.05 59.56,18.8 57.66,18.8 C2.2 C1.2 61.14,17.72 61.17,17.75 ; 61.17,18.77 61.17,17.75
GND: length 177.7
  Top Layer w0.152: 22.86,27.94 20.98,27.94 20.83,27.79 ; 22.86,27.94 v1(22.35,28.45) ; 22.86,27.94 U27.2 ; 22.86,27.94 23.88,27.94 23.88,25.47 24.8,24.55 U1.35 ; U1.8 27.8,13.86 28.58,13.08 28.58,10.8 28.7,10.67 29.72,10.67 U25.1 ; 29.72,10.86 U25.1 ; U25.1 30.67,10.73 v1(30.73,10.67) 31.69,10.67 U14.2 ; v1(41.4,18.54) 41.73,18.87 U9.18 ; PA.13 46.86,4.32 v1(45.97,5.21) ; U1.47 22.77,17.21 U19.1 ; U18.2 36.26,21.97 C15.1 37.02,23.67 38.67,25.32 ; v1(19.3,17.91) 19.75,17.91 U19.1 ; U19.1 20.44,17.21 U28.2 v1(16.64,17.21) ; USB1.5 v1(72.26,23.4) ; 57.68,21.78 53.79,21.78 53.49,22.09 53.49,22.78 ; U20.1 20.83,27.79 ; 20.83,27.79 v1(20.83,28.45) ; PB.2 v1(5.33,27.94) v1(5.33,26.8) 4.57,26.03 v1(4.44,26.03) 2.79,26.03 H7.1 ; 39.56,13.97 v1(40.64,13.97) ; C16.2 v1(39.26,27.05) ; 51.15,16.92 v1(51.43,16.64) 51.06,16.27 U9.3 U9.4 51.15,16.92
  Top Layer w0.203: v1(36.32,23.24) U18.2 34.94,23.24 ; 34.94,23.24 U26.1 ; 34.94,23.24 34.94,22.91 34.88,22.84 34.88,21.89 34.67,21.68 U1.23 ; U26.1 35.28,25.65 38.99,25.65 38.99,25.64 ; U26.1 36.02,25.32 v1(36.45,24.89) ; 38.67,25.32 38.99,25.64 ; 38.99,25.64 39.13,25.78
  Top Layer w0.3: v1(48.01,19.94) 48.01,20.07 49.87,20.07 ; U9.9 U9.10
  Top Layer w0.305: 14.86,5.96 14.93,5.89 X3.3 ; 14.86,5.96 14.86,6.42 ; 14.86,5.96 14.86,5.33 v1(15.49,4.7) v1(18.42,4.7) 20.7,4.7 ; X3.2 15.19,9.09 ; 15.19,9.09 v1(15.16,9.09) 14.86,9.4 14.86,10.16 v1(15.29,10.59) v1(18.16,10.59) v1(20.9,10.59) v1(23.83,10.59) ; 15.19,9.09 14.86,8.76 14.86,6.42 ; 72.24,27.56 72.26,27.56 ; 72.26,27.56 72.26,28.45 72.7,28.89 SWD.4 ; 72.26,27.56 72.26,27.44 72.13,27.31 ; 72.26,27.56 v1(73.41,27.56) ; v1(40.64,8.82) v1(40.64,7.49) v1(40.64,5.08) 37.46,5.08 v1(37.08,4.7) v1(33.27,4.7) 33.02,4.95 33.02,6.1 v1(32.89,6.22) 32.77,6.35 v1(29.34,6.35) 27.75,6.35 27.69,6.28 ; v1(40.64,8.82) 40.64,10.16 ; v1(40.64,8.82) 40.7,8.76 v1(41.4,8.76) ; v1(59.31,1.65) 60.64,1.65 C18.1 62.8,1.71 ; R1.2 v1(74.94,13.33) ; C8.2 40.64,10.16 ; 40.64,10.16 40.64,11.05 v1(40.13,11.56) v1(38.17,11.56) 33.15,11.56 v1(32.89,11.3) v1(32.89,9.78) v1(30.73,9.78) v1(29.72,9.78) ; CN1.5 63.43,8.2 v1(62.36,9.27) ; v1(42.55,4.44) 43.19,4.44 43.69,4.94 ; 59.81,16.28 v1(59.81,15.1) ; 17.84,12.45 20.25,12.45 U24.2 v1(20.32,11.43) ; 17.84,12.45 U13.2 v1(17.91,11.43) ; 17.84,12.45 15.75,12.45 15.75,13.46 15.37,13.84 U23.2 ; 62.8,1.71 64.2,1.71 64.76,2.28 CN1.6 ; 62.8,1.71 v1(62.86,1.65) ; 14.86,6.42 13.65,5.21 U10.4 ; 14.86,6.42 v1(14.93,6.49) ; C17.2 v1(51.43,8) ; C3.1 v1(66.8,14.1) ; C13.1 27.37,7.69 27.69,7.38 v1(27.69,7.37) 27.69,6.28 ; 27.69,6.28 C12.1 ; v1(24,3.81) PA.4 ; C4.1 v1(68.96,14.1) ; 57.65,16.28 v1(57.65,15.1) ; U2.2 v1(63.25,15.88)
  Bottom Layer w0.152: v1(48.01,19.94) 47.88,19.94
  Bottom Layer w0.305: v1(41.4,8.76) 41.27,8.76 ; v1(66.8,14.1) 66.8,13.97 ; U10.4 v1(11.81,3.3)
  vias: v1(20.57,4.7)
VCC3V3: length 270.5
  Top Layer w0.305: 70.36,16.45 69.98,16.83 64.8,16.83 ; 70.36,16.45 70.94,17.03 70.94,18.26 72.92,20.24 72.92,23.95 71.12,25.76 66.95,25.76 66.69,26.02 ; 70.36,16.45 70.36,14.11 70.66,13.8 LED1.2 ; v1(45.59,17.91) 45.36,17.68 44.43,17.68 44.32,17.57 U9.20 42.88,17.68 41.88,17.68 41.68,17.88 40.67,17.88 v1(40.64,17.91) ; v1(64.26,26.03) 64.28,26.02 66.69,26.02 ; 22.91,24.44 22.86,24.49 U27.1 ; 22.91,24.44 21.02,24.44 ; 22.91,24.44 23.45,24.44 ; 33.79,13.97 33.79,12.56 v1(34.04,12.32) 31.88,12.32 31.68,12.51 29.84,12.51 29.84,13.33 29.59,13.59 28.83,13.59 28.3,14.12 U1.9 ; v1(48.13,3.17) 48.13,4.69 KEY2.1 ; U28.1 18.04,15.81 U19.2 20.51,15.75 21.46,15.75 21.84,16.13 21.84,16.51 22.02,16.68 U1.48 ; U1.24 32.95,22.18 33.61,22.84 ; 66.69,26.02 66.54,26.17 R6.2 ; R10.1 4.95,9.53 4.32,8.89 4.32,5.33 U10.1 ; v1(30.47,1.65) 30.47,2.89 30.48,2.9 v1(30.48,5.08) ; 33.61,22.84 33.61,25.25 U26.2 v1(32.39,25.32) ; 33.61,22.84 33.54,22.91 ; v1(20.83,24.38) 20.83,24.26 20.83,24.26 21.02,24.44 ; v1(37.46,17.02) 36.39,17.02 C14.2 36.09,16.76 35.28,15.96 32.18,15.96 31.77,15.55 v1(31.77,15.11) ; 23.45,24.44 23.49,24.4 v1(23.49,23.62) ; 23.45,24.44 24.13,24.44 24.3,24.28 U1.36 ; R7.2 33.03,13.46 v1(30.73,13.46) ; 21.02,24.44 20.83,24.64 U20.2 ; 62.59,26.79 v1(62.59,26.03) ; SWD.1 65.28,29.86 65.28,28.7 65.53,28.45 66.55,28.45 66.55,27.43
  Top Layer w0.4: CN1.2 v1(73.16,1.27)
  Top Layer w0.45: v1(16.76,15.75) 17.97,15.75 U28.1 ; v1(26.54,1.02) PA.5
  Bottom Layer w0.305: v1(32.39,25.32) 26.67,25.32 24.98,23.62 v1(23.49,23.62) ; v1(45.59,17.91) 46.86,17.91 47.12,17.65 ; v1(37.46,17.02) 39.75,17.02 v1(40.64,17.91) ; 32.85,12.19 32.98,12.32 v1(34.04,12.32) 33.68,11.96 32.62,11.96 32.23,11.58 32.23,7.8 30.48,6.05 v1(30.48,5.08) ; v1(30.73,13.46) 31.52,14.25 32.64,14.25 v1(31.77,15.11) ; v1(20.83,24.38) 20.57,24.64 3.94,24.64 H7.2 ; v1(30.47,1.65) 30.48,1.65 30.48,0.8 30.44,0.76 ; v1(64.26,26.03) v1(62.59,26.03)
  Bottom Layer w0.45: PB.1 1.91,30.1 1.26,29.46 1.26,24.52 H7.2 1.78,23.24 1.26,22.72 1.26,4.58 4.19,1.65 ; 48.13,0.76 72.65,0.76 v1(73.16,1.27) ; 48.13,0.76 26.54,0.76 ; 48.13,0.76 v1(48.13,3.17) ; 13.59,0.76 26.29,0.76 v1(26.54,1.02) ; 13.59,0.76 13.59,12.57 v1(16.76,15.75) ; 13.59,0.76 5.08,0.76 4.19,1.65 ; 4.19,1.65 U10.1
VCC_BAT: length 12.5
  Top Layer w0.305: 24.26,15.31 24.26,14.35 23.69,13.78 U24.1 U13.1 16.7,13.78 16.26,14.22 16.26,15.11 16,15.37 U23.1
AO1: length 23.1
  Top Layer w0.152: U9.1 49.99,14.99 51.99,14.99 51.99,15.62 ; 51.99,15.62 52.07,15.62 52.07,15.62 52.07,25.53 54.86,28.32 57.89,28.32 58.04,28.47 58.04,29.72 ; 51.99,15.62 U9.2
AO2: length 16.7
  Top Layer w0.152: U9.5 50.01,17.53 51.31,17.53 51.43,17.65 51.43,18.15 51.36,18.22 ; 51.36,18.22 51.43,18.29 51.43,25.65 55.5,29.72 ; 51.36,18.22 U9.6
BO1: length 13.8
  Top Layer w0.152: 48.51,21.72 48.76,21.47 U9.11 ; 48.51,21.72 48.26,21.97 48.26,22.99 49.27,22.99 51.05,24.77 51.05,26.42 52.96,28.32 52.96,29.72 ; 48.51,21.72 48.91,22.12 U9.12
BO2: length 17.2
  Top Layer w0.152: 48.64,19.18 47.02,19.18 47.02,22.48 48.03,23.5 49.28,23.5 50.42,24.64 50.42,29.72 ; 48.64,19.18 48.98,19.52 U9.8 ; 48.64,19.18 48.89,18.92 49.92,18.92 U9.7
BOOT0: length 50.2
  Top Layer w0.152: 18.03,26.42 18.03,19.56 18.29,19.3 21.08,19.3 21.7,18.68 U1.44
  Top Layer w0.305: R3.1 v1(52.58,15.08) ; v1(24.26,17.91) 24.26,18.03 23.62,18.67 22.81,18.67 U1.44
  Bottom Layer w0.305: v1(52.58,15.08) 52.58,14.4 53.75,13.23 53.75,12.68 53.36,12.29 51.97,12.29 47.9,16.36 27.84,16.36 26.29,17.91 v1(24.26,17.91)
BOOT1: length 2.5
  Top Layer w0.305: U1.20 32.63,20.18 33.02,20.57 R4.2
BP5_RES: length 39.7
  Top Layer w0.152: v1(15.49,20.18) 7.61,20.18 4.57,17.14 4.57,16.13 4.06,15.62 H7.5 ; 19.18,26.54 19.18,20.57 19.3,20.45 21.46,20.45 21.73,20.18 U1.41 26.28,20.18 v1(26.29,20.19)
  Bottom Layer w0.152: v1(15.49,20.18) 15.71,19.96 26.06,19.96 v1(26.29,20.19)
OSCIN_8: length 19.6
  Top Layer w0.152: U1.5 26.3,11.04 27.3,10.03 28.19,10.03 28.45,9.78 28.45,7.75 28.96,7.24 31.23,7.24 R2.2 34.01,7.25 X2.2 38.52,6.08 C7.1
OSCOUT_8: length 17.9
  Top Layer w0.152: C8.1 38.52,10.18 X2.1 33.76,8.75 R2.1 31.23,8.76 29.21,8.76 28.83,9.14 28.83,9.91 28.32,10.41 27.43,10.41 26.8,11.05 U1.6
PA0_WKUP: length 49.2
  Top Layer w0.152: KEY2.2 45.71,12.84 44.7,13.84 42.01,13.84 41.27,14.58 41.27,14.87 41.03,15.11 33.39,15.11 32.41,14.12 29.16,14.12 28.8,14.48 U1.10
  Top Layer w0.305: KEY2.2 47.61,12.06 v1(47.24,12.06) ; v1(29.08,4.32) PA.6
  Bottom Layer w0.305: v1(29.08,4.32) 30.94,4.32 31.98,5.36 36.86,5.36 38.32,6.83 42.39,6.83 42.42,6.86 42.42,11.18 42.8,11.56 46.74,11.56 v1(47.24,12.06)
PA1_ADC: length 89.4
  Top Layer w0.152: 54.59,25.26 57.6,25.26 57.68,25.18 57.68,26.56 57.9,26.79 R14.1 ; 54.59,25.26 53.87,25.26 53.49,24.88 U22.2 ; 54.59,25.26 54.6,25.27 v1(54.61,25.27) ; U1.11 29.3,16.2 29.14,16.36 28.61,16.36 28.19,16.77 v1(28.19,17.4)
  Top Layer w0.2: v1(31.11,15.62) 30.61,15.62 29.99,16.23 29.33,16.23 29.3,16.2
  Top Layer w0.305: PA.7 31.75,2.54 v1(31.75,4.19)
  Bottom Layer w0.152: v1(54.61,25.27) 54.61,21.46 54.18,21.03 29.16,21.03 28.19,20.07 v1(28.19,17.4)
  Bottom Layer w0.305: v1(31.75,4.19) 32.85,4.19 33,4.04 41.12,4.04 48.13,11.05 47.9,11.28 47.9,12.34 47.52,12.73 39.73,12.73 36.6,15.85 31.47,15.85 31.24,15.62 v1(31.11,15.62)
PA2_PWMA: length 45.7
  Top Layer w0.152: 42.74,15.62 42.58,15.46 33.24,15.46 32.26,14.48 29.8,14.48 U1.12
  Top Layer w0.2: 41.94,15.46 41.65,15.17 41.65,14.74 42.14,14.25 45.31,14.25 45.67,13.89 49.01,13.89 49.19,13.72 49.19,11.96 49.01,11.79 48.21,11.79 40.51,4.09 39.02,4.09 37.97,3.05 37.97,1.52 37.37,1.52 37.16,1.31 36.25,1.31 35.14,2.41 PA.8 ; 42.74,15.62 U9.23
PA3_PWMB: length 44.4
  Top Layer w0.152: 42.74,20.82 41.14,20.82 v1(40.26,19.94) ; PA.9 35,4.11 33.03,4.11 31.38,5.77 29.26,5.77 v1(28.7,5.21) ; v1(26.54,16.64) 28.07,18.16 v1(28.83,18.16) 28.83,17.14 29.29,16.68 U1.13
  Bottom Layer w0.152: v1(28.83,18.16) 28.83,19.48 29.11,19.76 40.08,19.76 v1(40.26,19.94) ; v1(26.54,16.64) 26.54,12.45 28.83,10.16 28.83,9.78 28.7,9.65 v1(28.7,5.21)
PA4_AIN1: length 41.5
  Top Layer w0.152: U9.21 43.09,17.02 v1(44.7,17.02) ; v1(29.59,17.65) 30.06,17.18 U1.14 ; PA.10 40.54,3.71 40.67,3.71 48.36,11.41 49.17,11.41 49.91,12.15 v1(49.91,13.08) ; v1(48.01,17.02) v1(48.01,15.24) ; 42.74,16.92 42.55,17.11 40.17,17.11 38.73,18.54 34.42,18.54 v1(34.16,18.29)
  Bottom Layer w0.152: v1(48.01,15.24) 49.91,13.33 v1(49.91,13.08) ; v1(34.16,18.29) 33.53,17.65 v1(29.59,17.65) ; v1(48.01,17.02) v1(44.7,17.02)
PA5_AIN2: length 36.9
  Top Layer w0.152: U1.15 31.32,17.7 39.06,17.7 40.21,16.56 41.84,16.56 42.13,16.27 42.74,16.27 ; v1(46.61,14.61) 48.77,14.61 49.02,14.35 49.47,14.35 50.49,13.32 50.49,11.89 45.39,6.78 45.39,3.73 45.21,3.56 42.43,3.56 41.78,2.91 PA.11 ; v1(44.7,15.62) 44.5,15.62 43.85,16.27 U9.22
  Bottom Layer w0.152: v1(46.61,14.61) 45.72,14.61 v1(44.7,15.62)
PA6_BIN1: length 42
  Top Layer w0.152: 42.74,19.52 41.36,19.52 40.77,18.92 33.53,18.92 33.27,18.67 33.27,18.16 31.32,18.16 U1.16
  Top Layer w0.305: v1(45.08,19.43) 45,19.52 U9.17
  Bottom Layer w0.305: v1(45.08,19.43) 45.47,19.05 49.96,19.05 54.25,14.75 54.25,12.34 PA.12
PA7_BIN2: length 12.3
  Top Layer w0.152: 42.74,20.17 41.38,20.17 40.51,19.3 33.05,19.3 32.89,19.15 32.89,18.67 31.31,18.67 U1.17
PA8_STBY: length 37.2
  Top Layer w0.152: v1(27.81,22.35) 27.81,23.67 U1.29 27.89,23.77 27.89,27.02 28.43,27.56 32.89,27.56 33.27,27.94 PB.13
  Top Layer w0.305: U9.19 44.8,18.22 45.85,19.26 45.85,21.34 44.45,22.73 43.18,22.73 v1(42.67,23.24)
  Bottom Layer w0.305: v1(42.67,23.24) 37.26,23.24 36.52,22.5 27.97,22.5 v1(27.81,22.35)
PA9: length 9
  Top Layer w0.152: U1.30 27.3,23.69 27.3,27.56 27.69,27.94 30.35,27.94 30.73,28.32 30.73,29.72
PA10: length 7
  Top Layer w0.152: 28.19,29.72 28.19,28.7 27.81,28.32 27.18,28.32 26.8,27.94 26.8,23.69 U1.31
PA11_D-: length 53.2
  Top Layer w0.152: v1(64.64,24.64) R8.2 ; 25.65,29.72 25.65,28.97 26.29,28.34 26.29,23.69 U1.32 26.3,22.21 v1(26.54,21.97)
  Bottom Layer w0.152: v1(64.64,24.64) 65.02,25.02 65.02,26.54 63.63,27.94 60.52,27.94 59.1,26.47 54.34,26.47 49.78,21.72 26.8,21.72 v1(26.54,21.97)
PA12_D+: length 59.6
  Top Layer w0.152: 23.11,29.72 23.11,28.53 23.32,28.32 25.27,28.32 25.89,27.71 25.89,23.77 U1.33 25.8,22.12 v1(25.65,21.97) ; U8.2 64.9,20.19 64.64,20.45 v1(64.64,22.22) 64.66,22.24 65.79,22.24
  Bottom Layer w0.152: v1(25.65,21.97) 25.65,21.84 26.11,21.39 51.69,21.39 51.69,23.18 54.67,26.16 60.71,26.16 v1(64.64,22.22)
PA15_DHT11: length 30.7
  Top Layer w0.152: U10.2 6.73,6.86 7.24,7.37 8.97,7.37 9.48,7.87 R10.2 9.48,17.73 9.78,18.03 v1(12.32,18.03) ; v1(21.34,22.1) 21.75,21.68 U1.38
  Bottom Layer w0.152: v1(21.34,22.1) 15.24,22.1 12.32,19.18 v1(12.32,18.03)
PB0_KEY0: length 42.5
  Top Layer w0.152: U1.18 31.3,19.18 v1(29.72,19.18) ; v1(53.09,12.95) 54.6,12.95
  Top Layer w0.305: PA.14 50.63,3.64 50.63,8.99 KEY3.2
  Bottom Layer w0.152: 52.9,12.95 v1(53.09,12.95) 51.69,14.35 51.69,15.24 49.33,17.6 47.93,17.6 46.91,18.62 43.23,18.62 42.67,19.18 v1(29.72,19.18)
PB1_KEY1: length 63.7
  Top Layer w0.152: KEY4.2 58.76,13.51 55.83,13.51 54.86,14.48 54.86,16.26 53.98,17.14 53.98,21.05 52.76,22.27 52.76,25.58 54.61,27.43 v1(54.86,27.43) ; v1(48.13,26.67) 48.09,26.71 40.75,26.71 40.2,26.17 40.2,25 37.72,22.52 37.72,19.81 37.59,19.68 U1.19
  Top Layer w0.305: KEY4.2 59.44,8.14 55.26,3.96 53.49,3.96 PA.15
  Bottom Layer w0.152: v1(54.86,27.43) 50.55,27.43 49.78,26.67 v1(48.13,26.67)
PB3_D0: length 35.8
  Top Layer w0.152: 20.57,29.72 20.07,29.21 20.07,22.1 20.95,21.21 22.77,21.21 U1.39 24.61,21.18 v1(24.89,21.46) ; v1(15.49,21.46) 4.8,21.46 4.04,20.7 2.54,20.7
  Bottom Layer w0.152: v1(24.89,21.46) v1(15.49,21.46)
PB4_D1: length 39.8
  Top Layer w0.152: v1(16.13,20.83) 7.49,20.83 4.83,18.16 H7.4 ; 18.03,29.72 18.03,28.7 19.68,27.05 19.68,20.95 19.84,20.8 21.61,20.8 21.73,20.68 U1.40 25.51,20.68 v1(25.65,20.83)
  Bottom Layer w0.152: v1(25.65,20.83) v1(16.13,20.83)
PB6_DC: length 47.2
  Top Layer w0.152: v1(16.13,19.3) 15.84,19.6 7.79,19.6 4.95,16.76 4.95,13.59 4.44,13.08 H7.6 ; 15.49,29.72 15.49,28.5 17.73,28.5 18.8,27.43 18.8,20.19 18.92,20.07 21.33,20.07 21.72,19.68 U1.42 25.28,19.68 v1(25.65,19.3)
  Bottom Layer w0.152: v1(16.13,19.3) v1(25.65,19.3)
PB7_CS: length 50.8
  Top Layer w0.152: H7.7 4.7,10.54 5.33,11.18 5.33,16.51 8,19.18 14.98,19.18 v1(15.49,18.67) ; v1(24.89,18.67) 24.38,19.18 U1.43 21.71,19.18 21.21,19.69 18.54,19.69 18.39,19.84 18.39,27.08 17.32,28.14 13.13,28.14 12.95,28.32 12.95,29.72
  Bottom Layer w0.152: v1(15.49,18.67) v1(24.89,18.67)
PB8: length 22.7
  Top Layer w0.152: 10.41,29.72 10.41,28.07 10.69,27.79 17.04,27.79 17.65,27.17 17.65,19.3 18.03,18.92 20.85,18.92 21.59,18.18 U1.45
PB9: length 25.6
  Top Layer w0.152: U1.46 21.59,17.68 20.73,18.54 17.78,18.54 17.27,19.05 17.27,27.05 16.89,27.43 8.38,27.43 7.87,27.94 7.87,29.72
PB10: length 53.1
  Top Layer w0.152: 24.89,16.51 v1(24.77,16.64) 24.77,17.02 28.43,20.68 U1.21
  Bottom Layer w0.152: PA.16 52.88,4.01 46.94,4.01 45.78,2.86 45.78,2.35 44.77,1.33 43.88,1.33 43.24,1.97 43.24,2.35 43.05,2.54 43.05,3.05 42.61,3.49 28,3.49 27.05,4.44 27.05,10.6 26.83,10.82 26.83,11.39 24.77,13.46 v1(24.77,16.64)
PB11: length 58.4
  Top Layer w0.152: 27.56,20.83 27.43,20.83 ; 27.56,20.83 27.83,21.1 31.21,21.1 U1.22 ; 27.56,20.83 26.87,20.14 26.87,19.7 24,16.83 24,16.64 22.73,15.37 v1(22.73,14.99)
  Top Layer w0.305: PA.17 57.02,0.76 56.9,0.64 29.46,0.64 28.84,1.26 28.6,1.26 27.93,1.93 27.93,2.66 27.02,3.57 27.02,3.59 v1(26.8,3.81)
  Bottom Layer w0.152: v1(26.8,3.81) 26.62,3.99 26.62,10.53 26.48,10.67 26.48,11.24 v1(22.73,14.99)
PB12: length 18.1
  Top Layer w0.152: v1(43.31,27.69) 43.31,29.97 PB.17 ; U1.25 v1(30.73,23.68)
  Bottom Layer w0.152: v1(30.73,23.68) 35.94,23.68 36.08,23.83 38.63,23.83 40.2,25.4 40.2,26.17 41.72,27.69 v1(43.31,27.69)
PB13: length 16.1
  Top Layer w0.152: 40.89,29.72 40.89,28.58 40.51,28.19 38.99,28.19 37.08,26.29 29.59,26.29 29.3,26 U1.26
PB14: length 14.5
  Top Layer w0.152: 38.35,29.72 38.35,28.32 36.83,26.8 29.08,26.8 28.8,26.52 U1.27
PB15: length 12.8
  Top Layer w0.152: 35.81,29.72 35.81,28.19 34.82,27.2 28.58,27.2 28.3,26.93 U1.28
PC13: length 19.7
  Top Layer w0.305: v1(21.72,12.7) 23.75,12.7 24.8,13.75 U1.2
  Bottom Layer w0.305: v1(21.72,12.7) 21.56,12.54 21.56,7.27 21.59,7.24 21.59,4.78 20.85,4.04 17.04,4.04 17.02,4.06 16.51,3.56 16.51,2.54 PA.1
PC14_32.768: length 18
  Top Layer w0.152: X3.1 22.51,9.02 24.14,9.02 ; 21.59,2.92 21.59,3.81 21.97,4.19 22.99,4.19 24.13,5.33 24.13,9.01 24.14,9.02 ; 25.3,9.02 24.14,9.02 ; 25.3,9.02 C13.2 26.48,9.02 ; 25.3,9.02 U1.3
PC15_32.768: length 19
  Top Layer w0.152: v1(26.03,8) 26.03,6.03 C12.2 v1(25.27,5.97) ; v1(23.37,5.97) 22.51,5.97 X3.4 22.43,4.78 22.2,4.55 21.82,4.55 21.08,3.81 19.56,3.81 18.92,3.17 PA.2 ; v1(26.03,10.29) 26.03,10.31 25.8,10.54 U1.4
  Bottom Layer w0.152: v1(25.27,5.97) v1(23.37,5.97) ; v1(26.03,8) v1(26.03,10.29)
RESET: length 29.1
  Top Layer w0.152: 43.69,12.71 42.91,11.94 v1(41.15,11.94) 40.89,12.19 38.1,12.19 36.32,13.97 ; 36.32,13.97 35.3,13.97 ; 36.32,13.97 38.16,13.97 ; U1.7 27.3,14.23 27.43,14.1 v1(27.43,12.7) ; 43.04,13.49 43.69,12.84
  Bottom Layer w0.152: 41.15,11.81 40.77,12.19 39.5,12.19 38.79,12.9 32.97,12.9 32.89,12.83 27.69,12.83 27.43,12.57
SWCLK: length 55.5
  Top Layer w0.305: R5.2 70.62,28.69 v1(70.61,28.7) 70.61,29.6 SWD.3 ; v1(22.99,22.86) 22.99,22.37 U1.37
  Bottom Layer w0.305: v1(22.99,22.86) 22.73,23.11 22.73,25.15 26.47,28.88 41.31,28.88 41.51,29.08 41.53,29.08 41.67,28.94 43.91,28.94 43.93,28.96 63.94,28.96 64.19,28.7 v1(70.61,28.7)
SWDIO: length 51.1
  Top Layer w0.152: v1(25.27,24.89) 25.3,24.86 U1.34
  Top Layer w0.305: v1(68.05,26.42) R6.1 68.05,28.09 67.62,28.52 SWD.2
  Bottom Layer w0.305: 25.53,24.89 25.27,25.15 25.27,26.54 27.1,28.37 63.81,28.37 65.76,26.42 v1(68.05,26.42)
$1N4524: length 2.7
  Top Layer w0.305: 74.94,15.73 74.67,16 LED1.1
$1N6705: length 17.6
  Top Layer w0.305: CN1.3 68.96,10.62 68.66,10.92 63.11,10.92 60.08,13.95 57.18,13.95 56.05,15.08 R3.2
$1N6712: length 48.3
  Top Layer w0.305: v1(68.96,5.97) 68.96,4.76 ; 35.17,20.7 35.42,20.45 v1(36.96,20.45)
  Bottom Layer w0.305: v1(68.96,5.97) 68.39,6.54 60.13,6.54 58.67,8 58.67,20.07 57.3,20.07 56.77,20.6 39.99,20.6 39.84,20.45 v1(36.96,20.45)
$1N8192: length 5.8
  Top Layer w0.152: USB1.2 70.25,21.45 69.8,21.89 69.8,23.93 69.09,24.64 R8.1
$1N8237: length 5.7
  Top Layer w0.152: v1(69.21,22.1) 67.93,22.1 R9.1 ; v1(72.26,22.1) USB1.3
  Bottom Layer w0.152: v1(72.26,22.1) v1(69.21,22.1)
$1N32184: length 3.3
  Top Layer w0.152: C17.1 51.64,5.07 KEY3.1
$1N32195: length 3
  Top Layer w0.152: C18.2 60.71,4.7 60.46,4.94 KEY4.1

## Copper pours and planes (outline as drawn; the poured copper is in the pictures)
+5V on Top Layer: 56.64,17.01 60.33,17.01 60.83,16.51 61.85,16.51 61.98,16.38 62.8,16.38 62.8,17.57 62.21,18.16 61.98,18.16 61.72,18.42 61.72,19.43 59.05,19.43 58.8,19.69 56.64,19.69
+5V on Top Layer: 71.88,20.83 71.5,20.45 70.58,20.45 70.33,20.19 70.1,20.19 69.72,19.81 69.34,19.81 69.21,19.69 68.15,19.69 68.15,20.78 68.2,20.83 69.6,20.83 69.85,21.08 71.75,21.08 71.88,20.95
VCC3V3 on Top Layer: 64.27,17.91 64.27,16.78 63.88,16.38 63.99,16.28 67.05,16.28 67.2,16.12 70.73,16.12 70.74,16.13 70.74,17.27 70.1,17.91
VCC3V3 on Top Layer: 71.12,14.73 71.12,11.81 71.25,11.68 71.25,1.93 75.49,1.93 75.49,11.89 73.88,13.49 73.88,14.7 73.91,14.73

## Text on the board
Top Silkscreen Layer: GitHub: / GoKo-Son626
